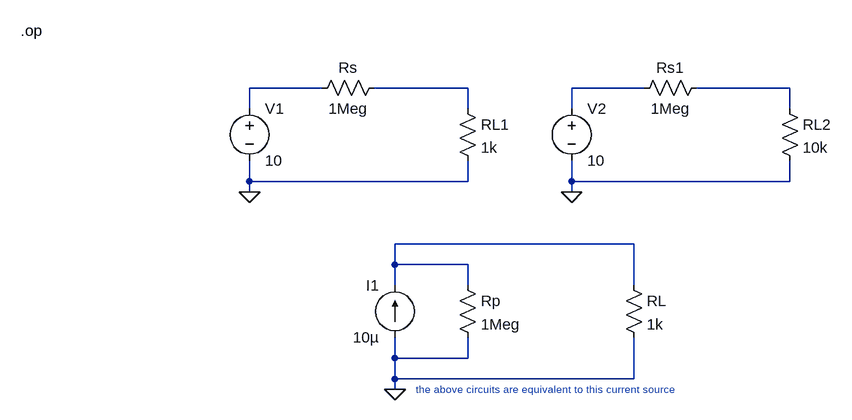
[diagram p0: schematic circuit.asc]
circuit.asc, the LTspice schematic file:
Version 4.1
SHEET 1 880 680
WIRE 64 80 -48 80
WIRE 288 80 144 80
WIRE 560 80 448 80
WIRE 784 80 640 80
WIRE -48 112 -48 80
WIRE 288 112 288 80
WIRE 448 112 448 80
WIRE 784 112 784 80
WIRE -48 224 -48 192
WIRE 288 224 288 192
WIRE 288 224 -48 224
WIRE 448 224 448 192
WIRE 784 224 784 192
WIRE 784 224 448 224
WIRE -48 240 -48 224
WIRE 448 240 448 224
WIRE 544 320 176 320
WIRE 176 352 176 320
WIRE 288 352 176 352
WIRE 176 384 176 352
WIRE 288 384 288 352
WIRE 544 384 544 320
WIRE 176 496 176 464
WIRE 288 496 288 464
WIRE 288 496 176 496
WIRE 176 528 176 496
WIRE 544 528 544 464
WIRE 544 528 176 528
WIRE 176 544 176 528
FLAG -48 240 0
FLAG 448 240 0
FLAG 176 544 0
DATAFLAG 272 80 "I(RL1)"
DATAFLAG 784 80 "I(RL2)"
DATAFLAG 544 320 "I(RL)"
SYMBOL voltage -48 96 R0
WINDOW 123 0 0 Left 0
WINDOW 39 0 0 Left 0
SYMATTR InstName V1
SYMATTR Value 10
SYMBOL res 160 64 R90
WINDOW 0 0 56 VBottom 2
WINDOW 3 32 56 VTop 2
SYMATTR InstName Rs
SYMATTR Value 1Meg
SYMBOL res 272 96 R0
SYMATTR InstName RL1
SYMATTR Value 1k
SYMBOL voltage 448 96 R0
WINDOW 123 0 0 Left 0
WINDOW 39 0 0 Left 0
SYMATTR InstName V2
SYMATTR Value 10
SYMBOL res 656 64 R90
WINDOW 0 0 56 VBottom 2
WINDOW 3 32 56 VTop 2
SYMATTR InstName Rs1
SYMATTR Value 1Meg
SYMBOL res 768 96 R0
SYMATTR InstName RL2
SYMATTR Value 10k
SYMBOL current 176 464 R180
WINDOW 0 24 80 Left 2
WINDOW 3 24 0 Left 2
WINDOW 123 0 0 Left 0
WINDOW 39 0 0 Left 0
SYMATTR InstName I1
SYMATTR Value 10µ
SYMBOL res 272 368 R0
SYMATTR InstName Rp
SYMATTR Value 1Meg
SYMBOL res 528 368 R0
SYMATTR InstName RL
SYMATTR Value 1k
TEXT -400 -8 Left 2 !.op
TEXT 208 544 Left 1 ;the above circuits are equivalent to this current source

The netlist it stands for:
* circuit.asc
V1 N001 0 10
Rs N002 N001 1Meg
RL1 N002 0 1k
V2 N003 0 10
Rs1 N004 N003 1Meg
RL2 N004 0 10k
I1 0 N005 10µ
Rp N005 0 1Meg
RL N005 0 1k
.op
* the above circuits are equivalent to this current source
.backanno
.end